# Altium schematic sheet hunnnan.SchDoc
size A4
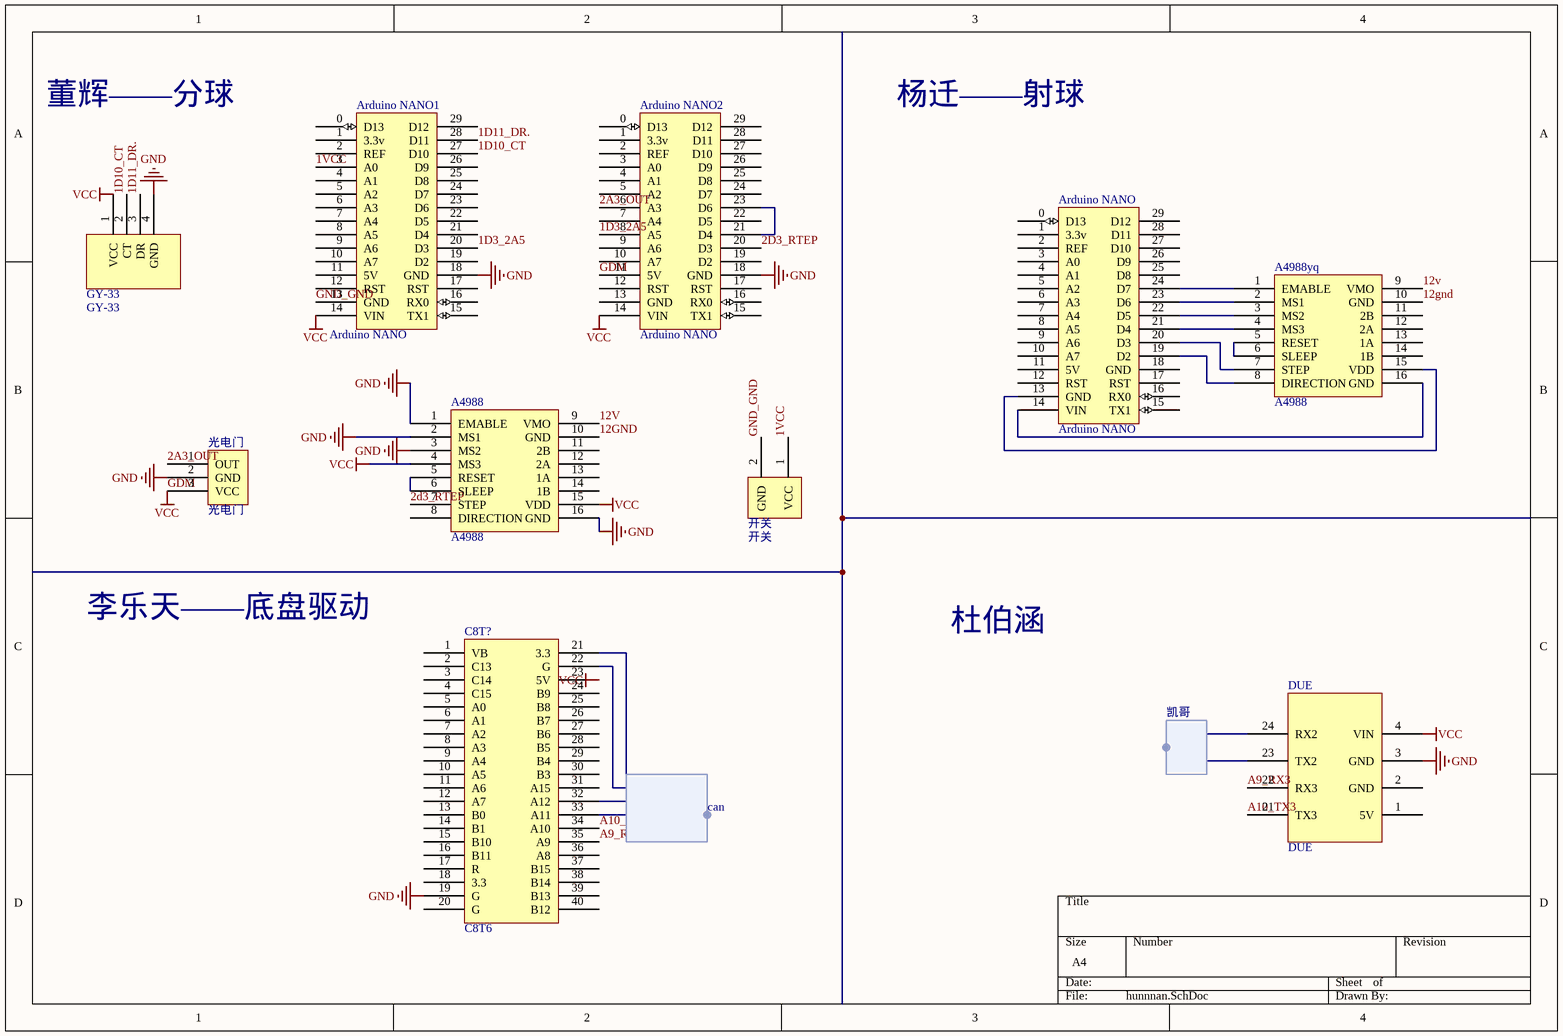
[diagram p0: hunnnan.SchDoc]

## Parts
A4988  A4988
A4988yq  A4988
Arduino_NANO  Arduino NANO  [Arduino NANO]
Arduino_NANO1  Arduino NANO  [Arduino NANO]
Arduino_NANO2  Arduino NANO  [Arduino NANO]
C8T?  C8T6  [C8T6]
DUE  DUE
GY-33  GY-33
光电门  光电门
开关  开关  [开关]

## Harnesses
can: 
凯哥: 

## Nets
GDM: A4988.4(MS3) A4988.15(VDD) Arduino_NANO1.14(VIN) Arduino_NANO2.11(5V) Arduino_NANO2.14(VIN) C8T?.23(5V) DUE.4(VIN) GY-33.1(VCC) 光电门.3(VCC)  [also labelled VCC]
GND: A4988.1(EMABLE) A4988.2(MS1) A4988.3(MS2) A4988.16(GND) Arduino_NANO1.18(GND) Arduino_NANO2.18(GND) C8T?.19(G) DUE.3(GND) GY-33.4(GND) 光电门.2(GND)
1D3_2A5: Arduino_NANO1.20(D3) Arduino_NANO2.8(A5)
1D10_CT: Arduino_NANO1.27(D10) GY-33.2(CT)
1D11_DR.: Arduino_NANO1.28(D11) GY-33.3(DR)
1VCC: Arduino_NANO1.3(A0) 开关.1(VCC)
2A3_OUT: Arduino_NANO2.6(A3) 光电门.1(OUT)
2D3_RTEP: A4988.7(STEP) Arduino_NANO2.20(D3)
12GND: A4988.10(GND) A4988yq.10(GND)
12V: A4988.9(VMO) A4988yq.9(VMO)
A9_RX3: C8T?.35(A9) DUE.22(RX3)
A10_TX3: C8T?.34(A10) DUE.21(TX3)
GND_GND: Arduino_NANO1.13(GND) 开关.2(GND)
NetA4988_5: A4988.5(RESET) A4988.6(SLEEP)
NetA4988yq_1: A4988yq.1(EMABLE) Arduino_NANO.24(D7)
NetA4988yq_2: A4988yq.2(MS1) Arduino_NANO.23(D6)
NetA4988yq_3: A4988yq.3(MS2) Arduino_NANO.22(D5)
NetA4988yq_4: A4988yq.4(MS3) Arduino_NANO.21(D4)
NetA4988yq_5: A4988yq.5(RESET) A4988yq.6(SLEEP)
NetA4988yq_7: A4988yq.7(STEP) Arduino_NANO.20(D3)
NetA4988yq_8: A4988yq.8(DIRECTION) Arduino_NANO.19(D2)
NetA4988yq_15: A4988yq.15(VDD) Arduino_NANO.13(GND)
NetA4988yq_16: A4988yq.16(GND) Arduino_NANO.14(VIN)
NetArduino_NANO2_21: Arduino_NANO2.21(D4) Arduino_NANO2.23(D6)

Not connected (* = marked no-connect by the designer): A4988 8(DIRECTION) 11(2B) 12(2A) 13(1A) 14(1B); A4988yq 11(2B) 12(2A) 13(1A) 14(1B); Arduino_NANO 0(D13) 1(3.3v) 2(REF) 3(A0) 4(A1) 5(A2) 6(A3) 7(A4) 8(A5) 9(A6) 10(A7) 11(5V) 12(RST) 15(TX1) 16(RX0) 17(RST) 18(GND) 25(D8) 26(D9) 27(D10) 28(D11) 29(D12); Arduino_NANO1 0(D13) 1(3.3v) 2(REF) 4(A1) 5(A2) 6(A3) 7(A4) 8(A5) 9(A6) 10(A7) 11(5V) 12(RST) 15(TX1) 16(RX0) 17(RST) 19(D2) 21(D4) 22(D5) 23(D6) 24(D7) 25(D8) 26(D9) 29(D12); Arduino_NANO2 0(D13) 1(3.3v) 2(REF) 3(A0) 4(A1) 5(A2) 7(A4) 9(A6) 10(A7) 12(RST) 13(GND) 15(TX1) 16(RX0) 17(RST) 19(D2) 22(D5) 24(D7) 25(D8) 26(D9) 27(D10) 28(D11) 29(D12); C8T? 1(VB) 2(C13) 3(C14) 4(C15) 5(A0) 6(A1) 7(A2) 8(A3) 9(A4) 10(A5) 11(A6) 12(A7) 13(B0) 14(B1) 15(B10) 16(B11) 17(R) 18(3.3) 20(G) 21(3.3) 22(G) 24(B9) 25(B8) 26(B7) 27(B6) 28(B5) 29(B4) 30(B3) 31(A15) 32(A12) 33(A11) 36(A8) 37(B15) 38(B14) 39(B13) 40(B12); DUE 1(5V) 2(GND) 23(TX2) 24(RX2)

## Notes on the sheet
- 董辉——分球
- 杨迁——射球
- 李乐天——底盘驱动
- 杜伯涵